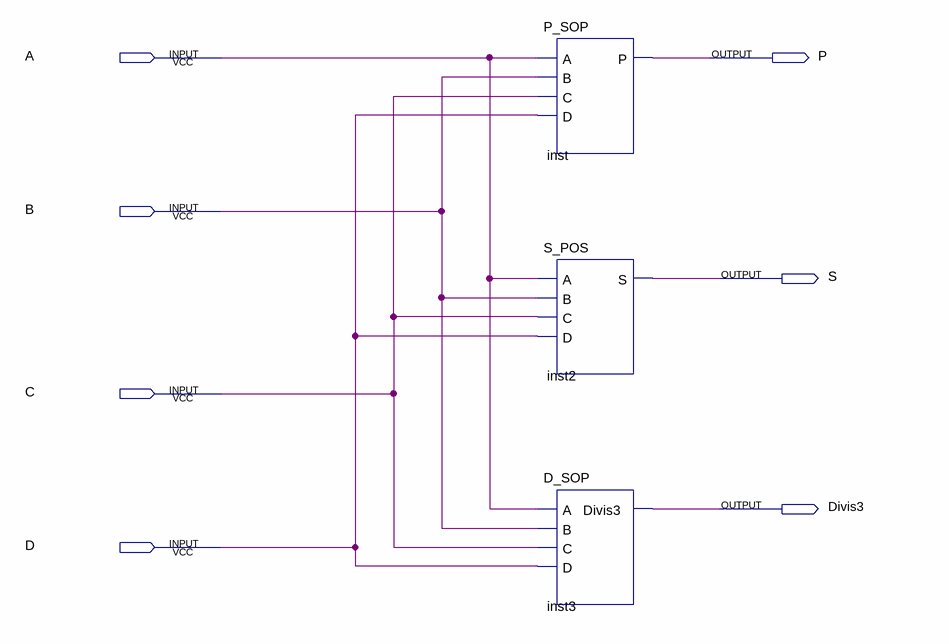
[diagram p0: schematic sheet]
// Quartus schematic Results.bdf as structural Verilog: 3 symbols, 7 pins
module Results (
  input  A,
  input  B,
  input  C,
  input  D,
  output P,
  output S,
  output Divis3
);

  P_SOP inst (.A(A), .B(B), .C(C), .D(D), .P(P));
  S_POS inst2 (.A(A), .B(B), .C(C), .D(D), .S(S));
  D_SOP inst3 (.A(A), .B(B), .C(C), .D(D), .Divis3(Divis3));
endmodule
